# Altium schematic sheet -NEW-AQB-5-ANTON_TRANS-PWR_Motion-Controller.SchDoc
size B; Organization: AQRONOS; Address1: 12789 Emerson St.; Address2: Thornton, CO  80021; Address3: USA
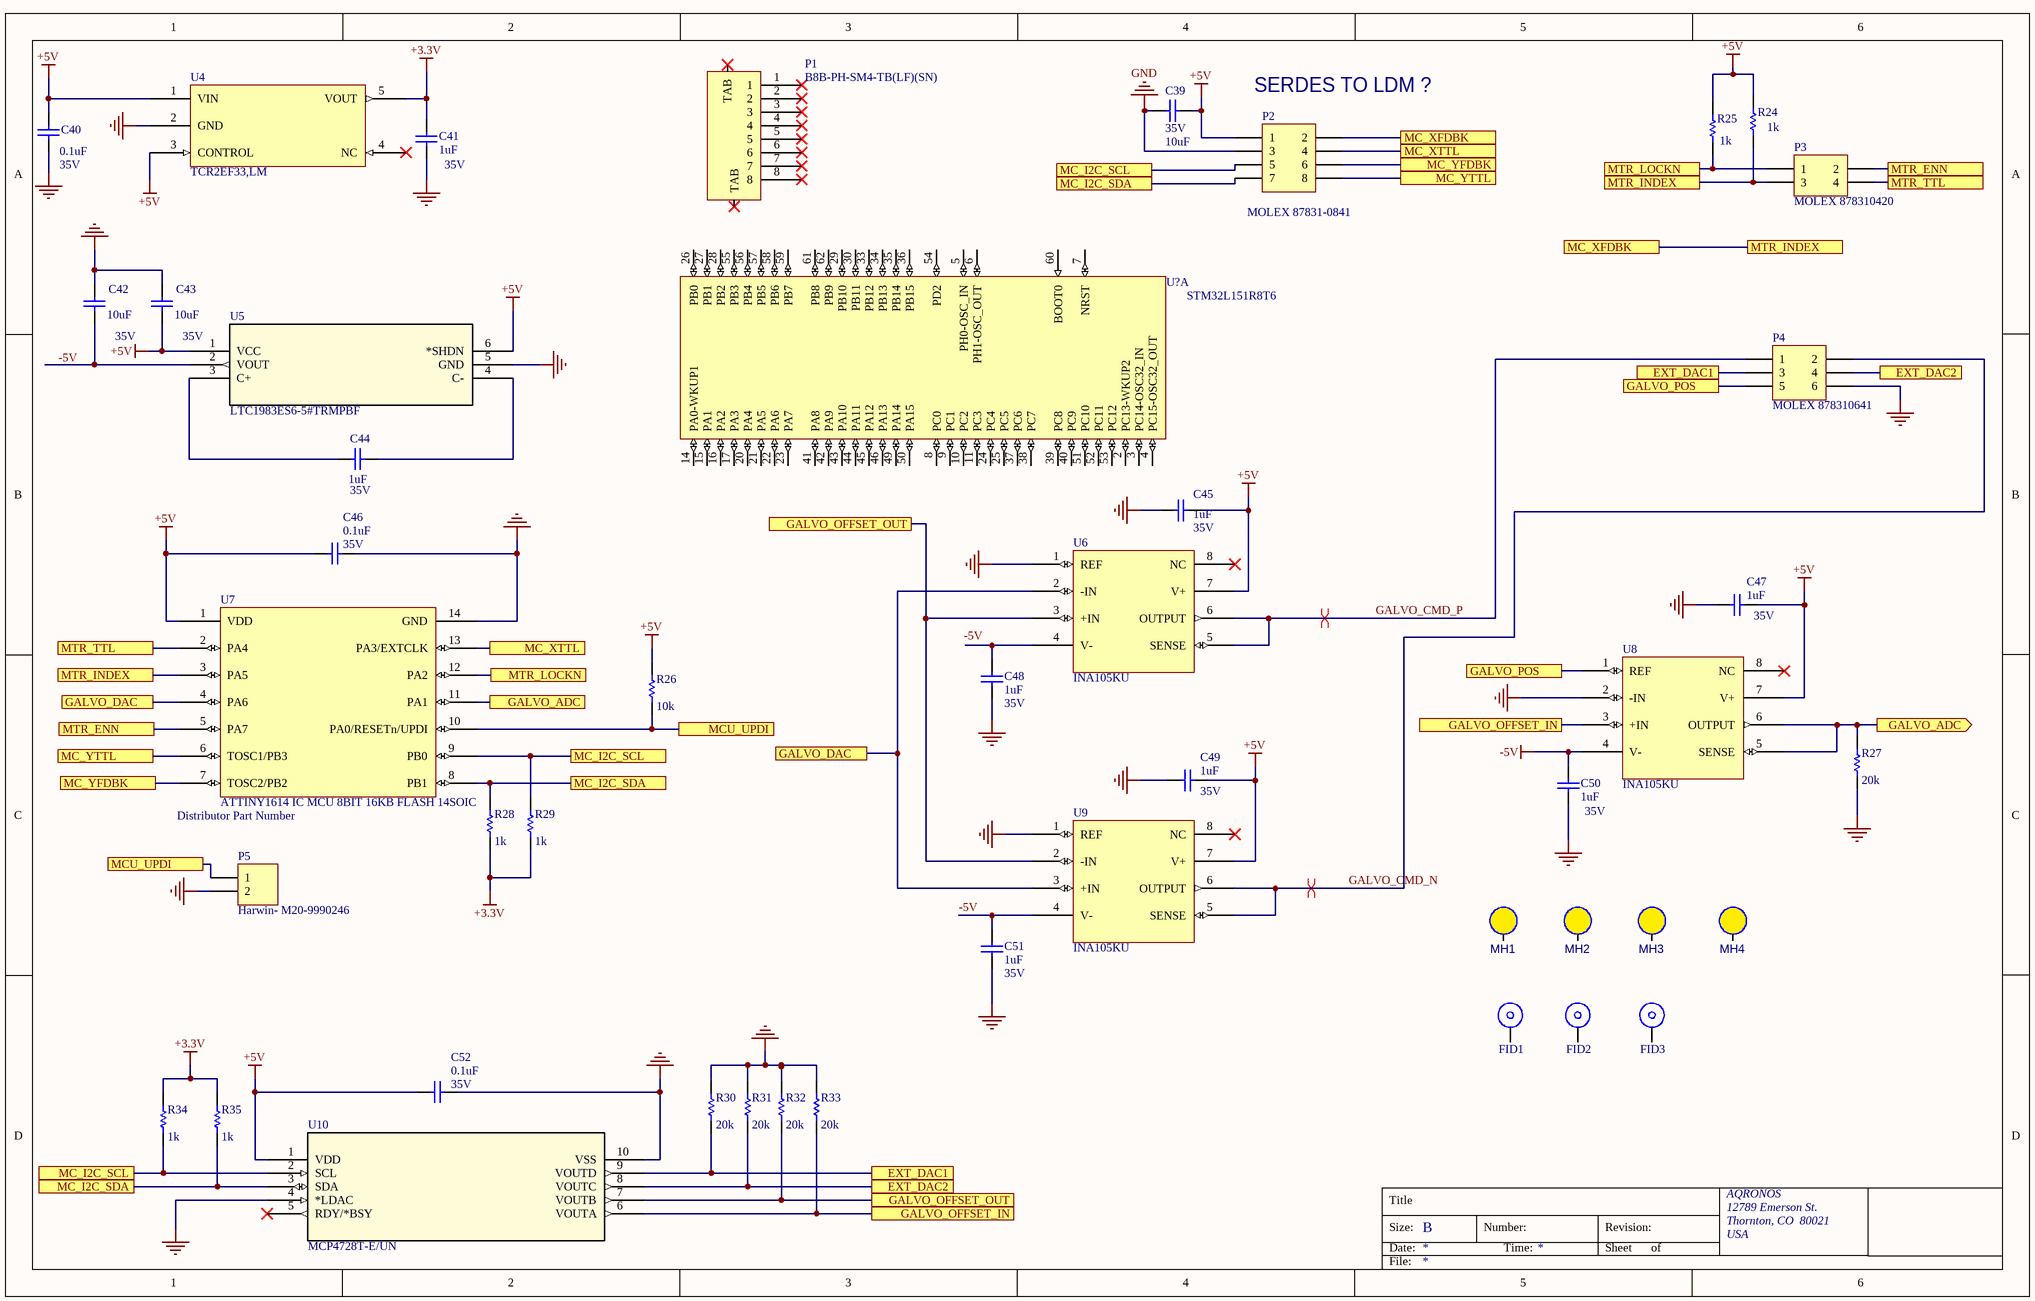
[diagram p0: -NEW-AQB-5-ANTON_TRANS-PWR_Motion-Controller.SchDoc]

## Parts
C39  value 10uF  Voltage: 35V  [CAP1206]  (hidden comment: Capacitor_non_pol)
C40  value 0.1uF  Voltage: 35V  [CAP0402]  (hidden comment: Capacitor_non_pol)
C41  value 1uF  Voltage: 35V  [CAP0402]  (hidden comment: Capacitor_non_pol)
C42  value 10uF  Voltage: 35V  [CAP1206]  (hidden comment: Capacitor_non_pol)
C43  value 10uF  Voltage: 35V  [CAP1206]  (hidden comment: Capacitor_non_pol)
C44  value 1uF  Voltage: 35V  [CAP0402]  (hidden comment: Capacitor_non_pol)
C45  value 1uF  Voltage: 35V  [CAP0402]  (hidden comment: Capacitor_non_pol)
C46  value 0.1uF  Voltage: 35V  [CAP0402]  (hidden comment: Capacitor_non_pol)
C47  value 1uF  Voltage: 35V  [CAP0402]  (hidden comment: Capacitor_non_pol)
C48  value 1uF  Voltage: 35V  [CAP0402]  (hidden comment: Capacitor_non_pol)
C49  value 1uF  Voltage: 35V  [CAP0402]  (hidden comment: Capacitor_non_pol)
C50  value 1uF  Voltage: 35V  [CAP0402]  (hidden comment: Capacitor_non_pol)
C51  value 1uF  Voltage: 35V  [CAP0402]  (hidden comment: Capacitor_non_pol)
C52  value 0.1uF  Voltage: 35V  [CAP0402]  (hidden comment: Capacitor_non_pol)
FID1  FIDUCIAL  [FID]  (value not drawn)
FID2  FIDUCIAL  [FID]  (value not drawn)
FID3  FIDUCIAL  [FID]  (value not drawn)
MH1  PAD-MH  [PAD-135Mils]  (value not drawn)
MH2  PAD-MH  [PAD-135Mils]  (value not drawn)
MH3  PAD-MH  [PAD-135Mils]  (value not drawn)
MH4  PAD-MH  [PAD-135Mils]  (value not drawn)
P1  B8B-PH-SM4-TB(LF)(SN)  [B8B-PH-SM4-TB(LF)(SN)]
P2  MOLEX 87831-0841  [HDR4X2-Molex]
P3  MOLEX 878310420  [HDR2X2-Molex]
P4  MOLEX 878310641  [HDR3X2-Molex]
P5  Harwin- M20-9990246  [HDR1X2]
R24  value 1k  [RES0402]  (hidden comment: Resistor)
R25  value 1k  [RES0402]  (hidden comment: Resistor)
R26  value 10k  [RES0402]  (hidden comment: Resistor)
R27  value 20k  [RES0402]  (hidden comment: Resistor)
R28  value 1k  [RES0402]  (hidden comment: Resistor)
R29  value 1k  [RES0402]  (hidden comment: Resistor)
R30  value 20k  [RES0402]  (hidden comment: Resistor)
R31  value 20k  [RES0402]  (hidden comment: Resistor)
R32  value 20k  [RES0402]  (hidden comment: Resistor)
R33  value 20k  [RES0402]  (hidden comment: Resistor)
R34  value 1k  [RES0402]  (hidden comment: Resistor)
R35  value 1k  [RES0402]  (hidden comment: Resistor)
U4  TCR2EF33,LM  [SOT-753]
U5  LTC1983ES6-5#TRMPBF  [SOT-23-6]
U6  INA105KU  [SOIC8]
U7  ATTINY1614 IC MCU 8BIT 16KB FLASH 14SOIC  [SOIC14]
U8  INA105KU  [SOIC8]
U9  INA105KU  [SOIC8]
U10  MCP4728T-E/UN  [MSOP10]
U?  STM32L151R8T6  [STM-LQFP64_N]  (part A of 2)

## Ports
EXT_DAC1, EXT_DAC2, GALVO_ADC, GALVO_ADC (out), GALVO_DAC, GALVO_OFFSET_IN, GALVO_OFFSET_OUT, GALVO_POS, MC_I2C_SCL, MC_I2C_SDA, MC_XFDBK, MC_XTTL, MC_YFDBK, MC_YTTL, MCU_UPDI, MTR_ENN, MTR_INDEX, MTR_LOCKN, MTR_TTL

## Nets
+3.3V: C41.1 R28.1 R29.1 R34.2 R35.2 U4.5(VOUT)
+5V: C39.2 C40.1 C43.2 C45.2 C46.2 C47.2 C49.2 C52.2 P2.1 R24.2 R25.2 R26.2 U4.1(VIN) U4.3(CONTROL) U5.1(VCC) U5.6(*SHDN) U6.7(V+) U7.1(VDD) U8.7(V+) U9.7(V+) U10.1(VDD)
-5V: C50.1 C51.1 U8.4(V-) U9.4(V-)
GND: C39.1 C40.2 C41.2 C42.1 C43.1 C45.1 C46.1 C47.1 C48.2 C49.1 C50.2 C51.2 C52.1 P2.3 P4.6 P5.2 R27.1 R30.2 R31.2 R32.2 R33.2 U4.2(GND) U5.5(GND) U6.1(REF) U7.14(GND) U8.2(-IN) U9.1(REF) U10.4(*LDAC) U10.10(VSS)
EXT_DAC1: P4.3 R30.1 U10.9(VOUTD) ; port EXT_DAC1
EXT_DAC2: P4.4 R31.1 U10.8(VOUTC) ; port EXT_DAC2
GALVO_ADC: R27.2 U7.11(PA1) U8.5(SENSE) U8.6(OUTPUT) ; port GALVO_ADC
GALVO_CMD_N: P4.2 U9.5(SENSE) U9.6(OUTPUT)
GALVO_CMD_P: P4.1 U6.5(SENSE) U6.6(OUTPUT)
GALVO_DAC: U6.2(-IN) U7.4(PA6) U9.3(+IN) ; port GALVO_DAC
GALVO_OFFSET_IN: R33.1 U8.3(+IN) U10.6(VOUTA) ; port GALVO_OFFSET_IN
GALVO_OFFSET_OUT: R32.1 U6.3(+IN) U9.2(-IN) U10.7(VOUTB) ; port GALVO_OFFSET_OUT
GALVO_POS: P4.5 U8.1(REF) ; port GALVO_POS
MC_I2C_SCL: P2.5 R29.2 R34.1 U7.9(PB0) U10.2(SCL) ; port MC_I2C_SCL
MC_I2C_SDA: P2.7 R28.2 R35.1 U7.8(PB1) U10.3(SDA) ; port MC_I2C_SDA
MC_XFDBK: P2.2 P3.3 R24.1 U7.3(PA5) ; port MC_XFDBK, port MTR_INDEX
MC_XTTL: P2.4 U7.13(PA3/EXTCLK) ; port MC_XTTL
MC_YFDBK: P2.6 U7.7(TOSC2/PB2) ; port MC_YFDBK
MC_YTTL: P2.8 U7.6(TOSC1/PB3) ; port MC_YTTL
MCU_UPDI: P5.1 R26.1 U7.10(PA0/RESETn/UPDI) ; port MCU_UPDI
MTR_ENN: P3.2 U7.5(PA7) ; port MTR_ENN
MTR_LOCKN: P3.1 R25.1 U7.12(PA2) ; port MTR_LOCKN
MTR_TTL: P3.4 U7.2(PA4) ; port MTR_TTL
NetC42_2: C42.2 U5.2(VOUT)
NetC44_1: C44.1 U5.3(C+)
NetC44_2: C44.2 U5.4(C-)
NetC48_1: C48.1 U6.4(V-)

Not connected (* = marked no-connect by the designer): MH1 1; MH2 1; MH3 1; MH4 1; P1 1* 2* 3* 4* 5* 6* 7* 8* TAB*; U4 4(NC)*; U6 8(NC)*; U8 8(NC)*; U9 8(NC)*; U10 5(RDY/*BSY)*; U? 2(PC13-WKUP2) 3(PC14-OSC32_IN) 4(PC15-OSC32_OUT) 5(PH0-OSC_IN) 6(PH1-OSC_OUT) 7(NRST) 8(PC0) 9(PC1) 10(PC2) 11(PC3) 14(PA0-WKUP1) 15(PA1) 16(PA2) 17(PA3) 20(PA4) 21(PA5) 22(PA6) 23(PA7) 24(PC4) 25(PC5) 26(PB0) 27(PB1) 28(PB2) 29(PB10) 30(PB11) 33(PB12) 34(PB13) 35(PB14) 36(PB15) 37(PC6) 38(PC7) 39(PC8) 40(PC9) 41(PA8) 42(PA9) 43(PA10) 44(PA11) 45(PA12) 46(PA13) 49(PA14) 50(PA15) 51(PC10) 52(PC11) 53(PC12) 54(PD2) 55(PB3) 56(PB4) 57(PB5) 58(PB6) 59(PB7) 60(BOOT0) 61(PB8) 62(PB9)

## Layout directives
differential pair: GALVO_CMD_N, GALVO_CMD_P

## Notes on the sheet
- (near P2) SERDES TO LDM ?
- Title
- Size:
- Date:
- B
- Number:
- Time:
- Revision:
- Sheet
- of
- File:
- Labels drawn without touching a wire or pin: -5V
- (in symbol ATTINY1614-SSFR) Distributor Part Number

## Library data of the parts
C39 C42 C43 = Capacitor_non_pol: Manufacturer Part Number: CGA5L1X7R1V106K160AC; Distributor Part Number: 445-174428-1-ND; Footprint: *; P/N: *; Tolerance: *; Vendor: *; Manufacturer: *; Power: *; Current: *
C40 C46 C52 = Capacitor_non_pol: Manufacturer Part Number: GMK107B7104KAHT; Distributor Part Number: 587-3354-1-ND; P/N: *; Tolerance: *; Vendor: *; Manufacturer: *; Power: *; Current: *
  C40 C52: Footprint: 0402
C41 C44 C45 C47-C51 = Capacitor_non_pol: Manufacturer Part Number: GMK107AB7105KAHT; Distributor Part Number: 587-3352-1-ND; Footprint: *; P/N: *; Tolerance: *; Vendor: *; Manufacturer: *; Power: *; Current: *
FID1-FID3 = FID
MH1-MH4 = PAD-MH: PAD,MOUNTING HOLE
P1 = B8B-PH-SM4-TB(LF)(SN): 8 PIN JST SMT 2.0 MM PITCH; Value: CONN-8; Manufacturer Part Number: B8B-PH-SM4-TB(LF)(SN); Distributor Part Number: 455-1740-1-ND
P2 = HDR4x2-87831-0841: Connector Header Through Hole 8 position 0.079" (2.00mm); Manufacturer Part Number: 0878310841; Digi-Key Part Number: WM8611-ND; Footprint: HDR4x2-Molex; P/N: *; Tolerance: *; Value: *; Vendor: Molex; Distributor Part Number: WM8611-ND
P3 = HDR2x2-878310420: Connector Header Through Hole 4 position 0.079" (2.00mm); Manufacturer Part Number: 87831-0420; Digi-Key Part Number: WM18557-ND; Footprint: HDR2x2-Molex; P/N: *; Tolerance: *; Value: *; Vendor: Molex; Distributor Part Number: WM18557-ND
P4 = HDR3x2-878310641: Connector Header Through Hole 6 position 0.079" (2.00mm); Digi-Key Part Number: WM3590-ND; Footprint: HDR3x2-Molex; Manufacturer Part Number: 878310641; P/N: *; Tolerance: *; Value: *; Vendor: Molex; Distributor Part Number: WM3590-ND
P5 = HDR1x2-M20-9990246: Connector Header Through Hole 2 position 0.100" (2.54mm); Value: CONN-2; Vendor: Harwin Inc.; Digi-Key Part Number: 952-2262-ND; Manufacturer Part Number: M20-9990246; Tolerance: *; Distributor Part Number: 952-2262-ND
R24 R25 R28 R29 R34 R35 = Resistor: Manufacturer Part Number: ERJ-2GEJ102X; Digi-Key Part Number: *; P/N: *; Tolerance: *; Vendor: *; Voltage: *; Power: *; Current: *; Distributor Part Number: P1.0KJCT-ND
  R24 R25 R35: Footprint: *; HelpURL: *
  R29 R34: HelpURL: *; Distributor Part Number: *
R26 = Resistor: Manufacturer Part Number: ERJ-2GEJ103X; Digi-Key Part Number: *; HelpURL: *; P/N: *; Tolerance: *; Vendor: *; Voltage: *; Power: *; Current: *; Distributor Part Number: P10KJCT-ND
R27 R30-R33 = Resistor: Manufacturer Part Number: ERJ-2RKF2002X; Digi-Key Part Number: *; Footprint: *; HelpURL: *; P/N: *; Tolerance: *; Vendor: *; Voltage: *; Power: *; Current: *; Distributor Part Number: P20.0KLCT-ND
U4 = TCR2EF33,LM: Linear Voltage Regulator IC Positive Fixed 1 Output 200mA SMV; Manufacturer Part Number: TCR2EF33,LM(CT; Vendor: Toshiba Semiconductor and Storage; P/N: *; HelpURL: *; Tolerance: *; Value: *; Digikey Part Number: TCR2EF33LM(CTTR-ND; Distributor Part Number: TCR2EF33LM(CTTR-ND
U5 = LTC1983ES6-5#TRM: Charge Pump Switching Regulator IC Negative Fixed -5V 1 Output 100mA SOT-23-6 Thin, TSOT-23-6; Vendor: Linear Technology/Analog Devices; Manufacturer Part Number: LTC1983ES6-5#TRMPBF; Value: *; HelpURL: *; P/N: *; Footprint: SOT-23_S6; Tolerance: *; Distributor Part Number: LTC1983ES6-5#TRMPBFCT-ND
U6 U8 U9 = INA105: IC OPAMP DIFFERENTIAL 1MHZ 8SOIC; Vendor: Texas Instruments; Tolerance: *; Value: *; Voltage: *; Digi-Key Part Number: 296-44407-5-ND; Manufacturer Part Number: INA105KU; Distributor Part Number: 296-44407-5-ND
U7 = ATTINY1614-SSFR: AVR tinyAVR™ 1 Microcontroller IC 8-Bit 20MHz 16KB (16K x 8) FLASH 14-SOIC; Vendor: Microchip Technology; Value: *; P/N: *; Tolerance: *; HelpURL: *; Digi-Key Part Number: ATTINY1614-SSFRCT-ND; Manufacturer Part Number: ATTINY1614-SSFR; Distributor Part Number: ATTINY1614-SSFRCT-ND; Distributor Part Number: *
U10 = MCP4728T-E/UN: 12 Bit Digital to Analog Converter 4 10-MSOP; Vendor: Microchip Technology; Manufacturer Part Number: MCP4728T-E/UN; Value: *; Digi-Key Part Number: MCP4728T-E/UNTR-ND; P/N: *; Tolerance: *; Distributor Part Number: MCP4728T-E/UNTR-ND
U? = STM32L151R8T6: ARM Cortex-M3 32-bit MCU, 64 KB Flash, 10 KB Internal RAM, 51 I/Os, 64-pin LQFP, -40 to 85 degC, Tray; Manufacturer: STMicroelectronics; D/A Converter: 2x12-bit (2 Channel); Data E2PROM nom (B): 4096; FLASH Size (Prog) (kB): 64; I/Os (High Current): 51; Internal RAM Size (kB): 10; Operating Frequency(F) (Processor speed) (MHz): 32; Supply Voltage(Vcc) min (V): 1.65; DatasheetVersion: Rev. 8; PackageVersion: Rev. 4, 06/2013; PackageReference: LQFP64; PackageDescription: 64-Pin Low Profile Quad Flat Package, 10 x 10 mm Body, 0.5 mm Pitch; Core: ARM Cortex-M3; Packing: Tray; Mounting Technology: Surface Mount; PartNumber: STM32L151R8T6; ComponentLink1Description: Manufacturer URL; ComponentLink1URL: http://www.st.com/web/en/home.html; ComponentLink2Description: Datasheet; ComponentLink2URL: http://www.st.com/st-web-ui/static/active/en/resource/technical/document/datasheet/CD00277537.pdf; ComponentLink3Description: Package Specification; ComponentLink3URL: http://www.st.com/st-web-ui/static/active/en/resource/technical/document/datasheet/DM00037051.pdf